# EAGLE design Buck Regulator (EAGLE 9.6.2)

## Sheet 1 of 2: Datasheet
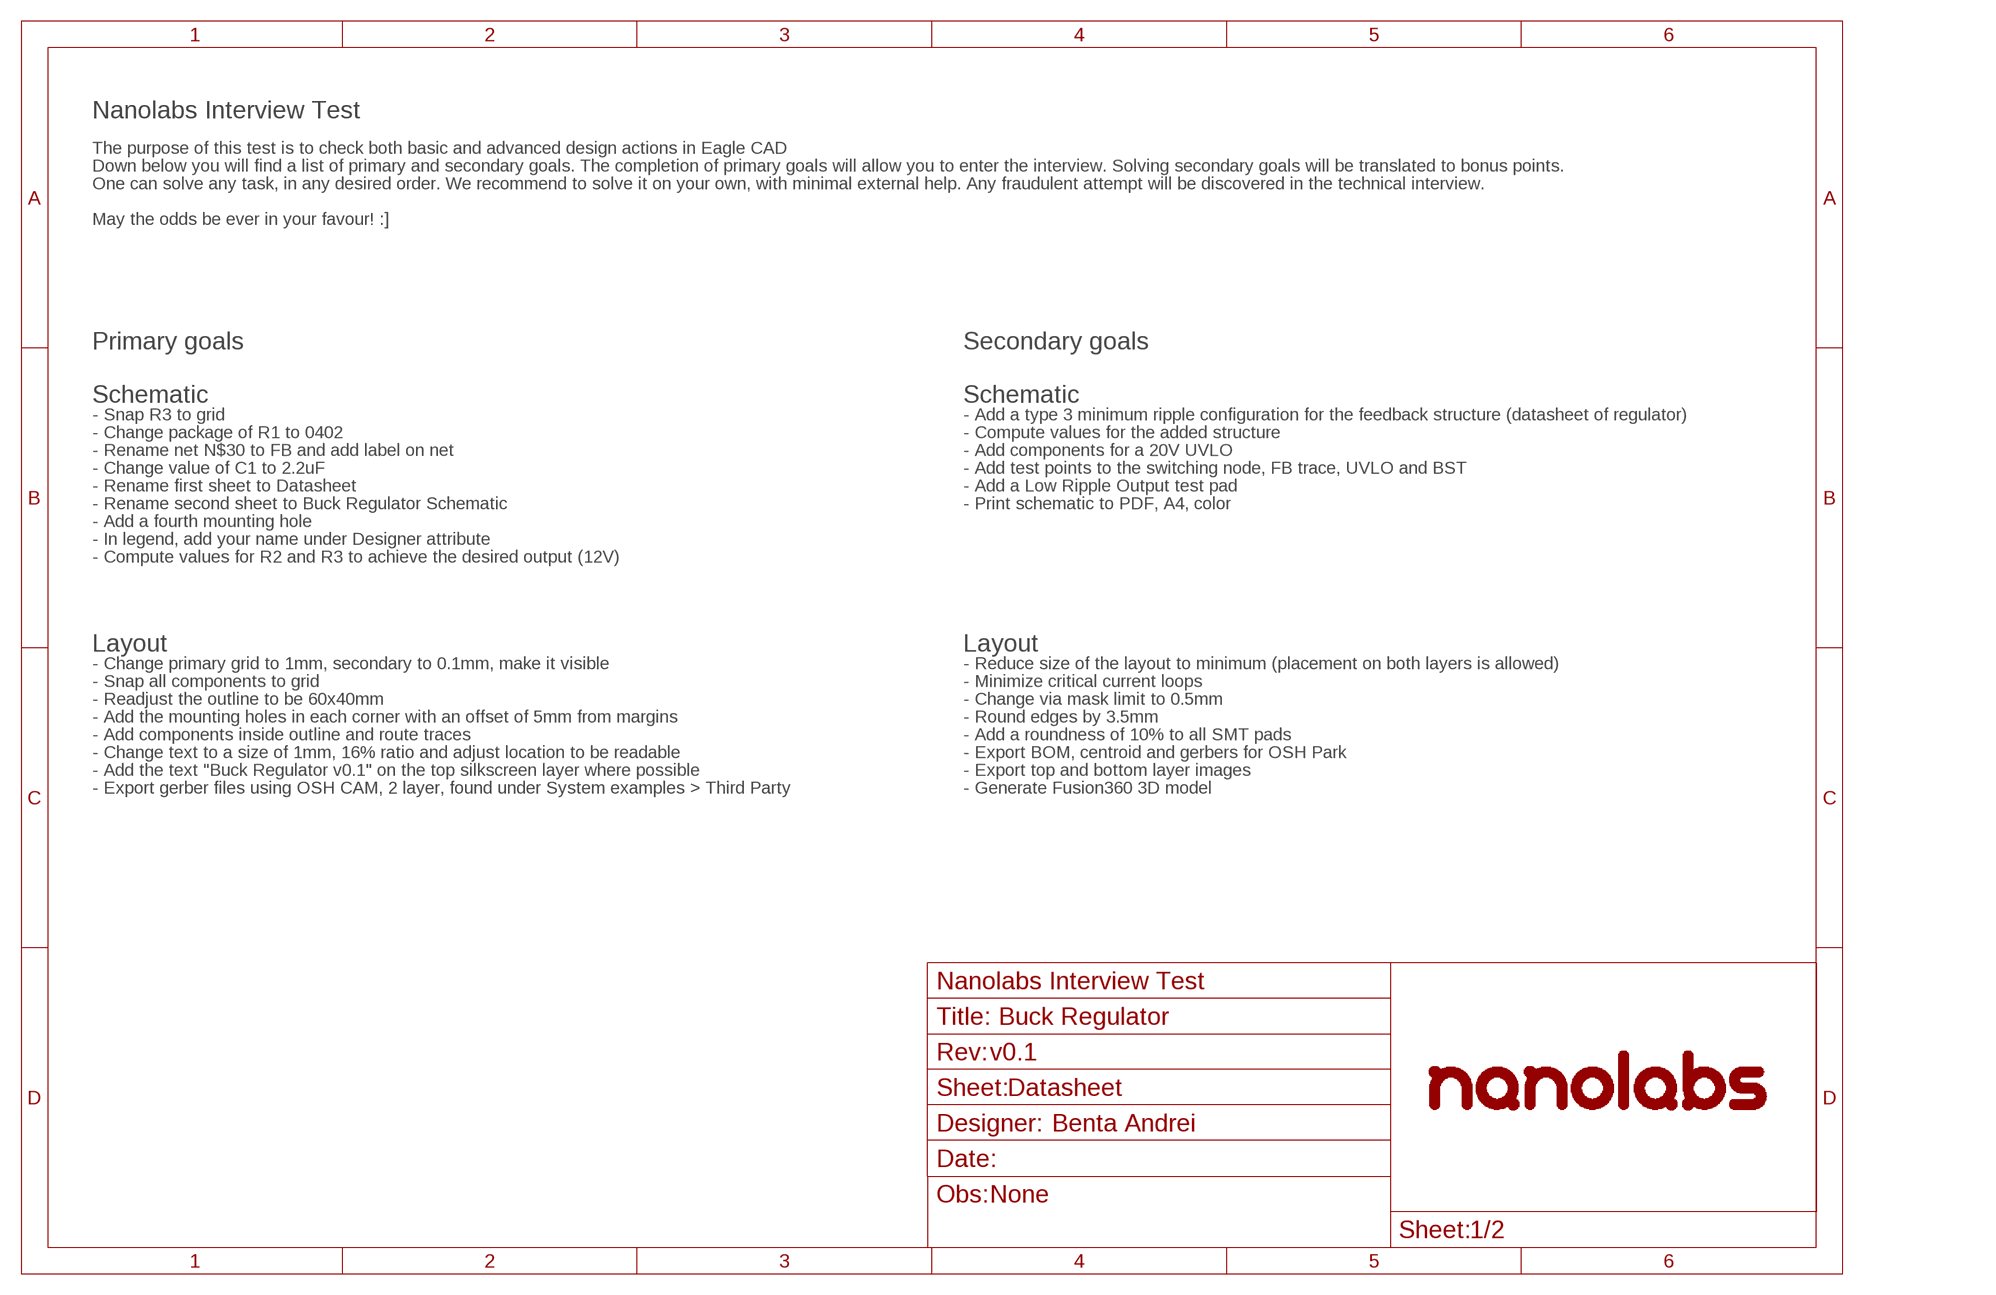
[diagram p0: schematic, sheet 1]
FRAME3 (_SCH_FRAME_A4): OBS: None; REVNUM: v0.1

### Notes on the sheet
- Nanolabs Interview Test
- The purpose of this test is to check both basic and advanced design actions in Eagle CAD
- Down below you will find a list of primary and secondary goals. The completion of primary goals will allow you to enter the interview. Solving secondary goals will be translated to bonus points.
- One can solve any task, in any desired order. We recommend to solve it on your own, with minimal external help. Any fraudulent attempt will be discovered in the technical interview.
- May the odds be ever in your favour! :]
- Primary goals | Secondary goals
- Schematic | Schematic
- - Snap R3 to grid | - Add a type 3 minimum ripple configuration for the feedback structure (datasheet of regulator)
- - Change package of R1 to 0402 | - Compute values for the added structure
- - Rename net N$30 to FB and add label on net | - Add components for a 20V UVLO
- - Change value of C1 to 2.2uF | - Add test points to the switching node, FB trace, UVLO and BST
- - Rename first sheet to Datasheet | - Add a Low Ripple Output test pad
- - Rename second sheet to Buck Regulator Schematic | - Print schematic to PDF, A4, color
- - Add a fourth mounting hole
- - In legend, add your name under Designer attribute
- - Compute values for R2 and R3 to achieve the desired output (12V)
- Layout | Layout
- - Change primary grid to 1mm, secondary to 0.1mm, make it visible | - Reduce size of the layout to minimum (placement on both layers is allowed)
- - Snap all components to grid | - Minimize critical current loops
- - Readjust the outline to be 60x40mm | - Change via mask limit to 0.5mm
- - Add the mounting holes in each corner with an offset of 5mm from margins | - Round edges by 3.5mm
- - Add components inside outline and route traces | - Add a roundness of 10% to all SMT pads
- - Change text to a size of 1mm, 16% ratio and adjust location to be readable | - Export BOM, centroid and gerbers for OSH Park
- - Add the text "Buck Regulator v0.1" on the top silkscreen layer where possible | - Export top and bottom layer images
- - Export gerber files using OSH CAM, 2 layer, found under System examples > Third Party | - Generate Fusion360 3D model
- Benta Andrei

## Sheet 2 of 2: Buck Regulator Schematic
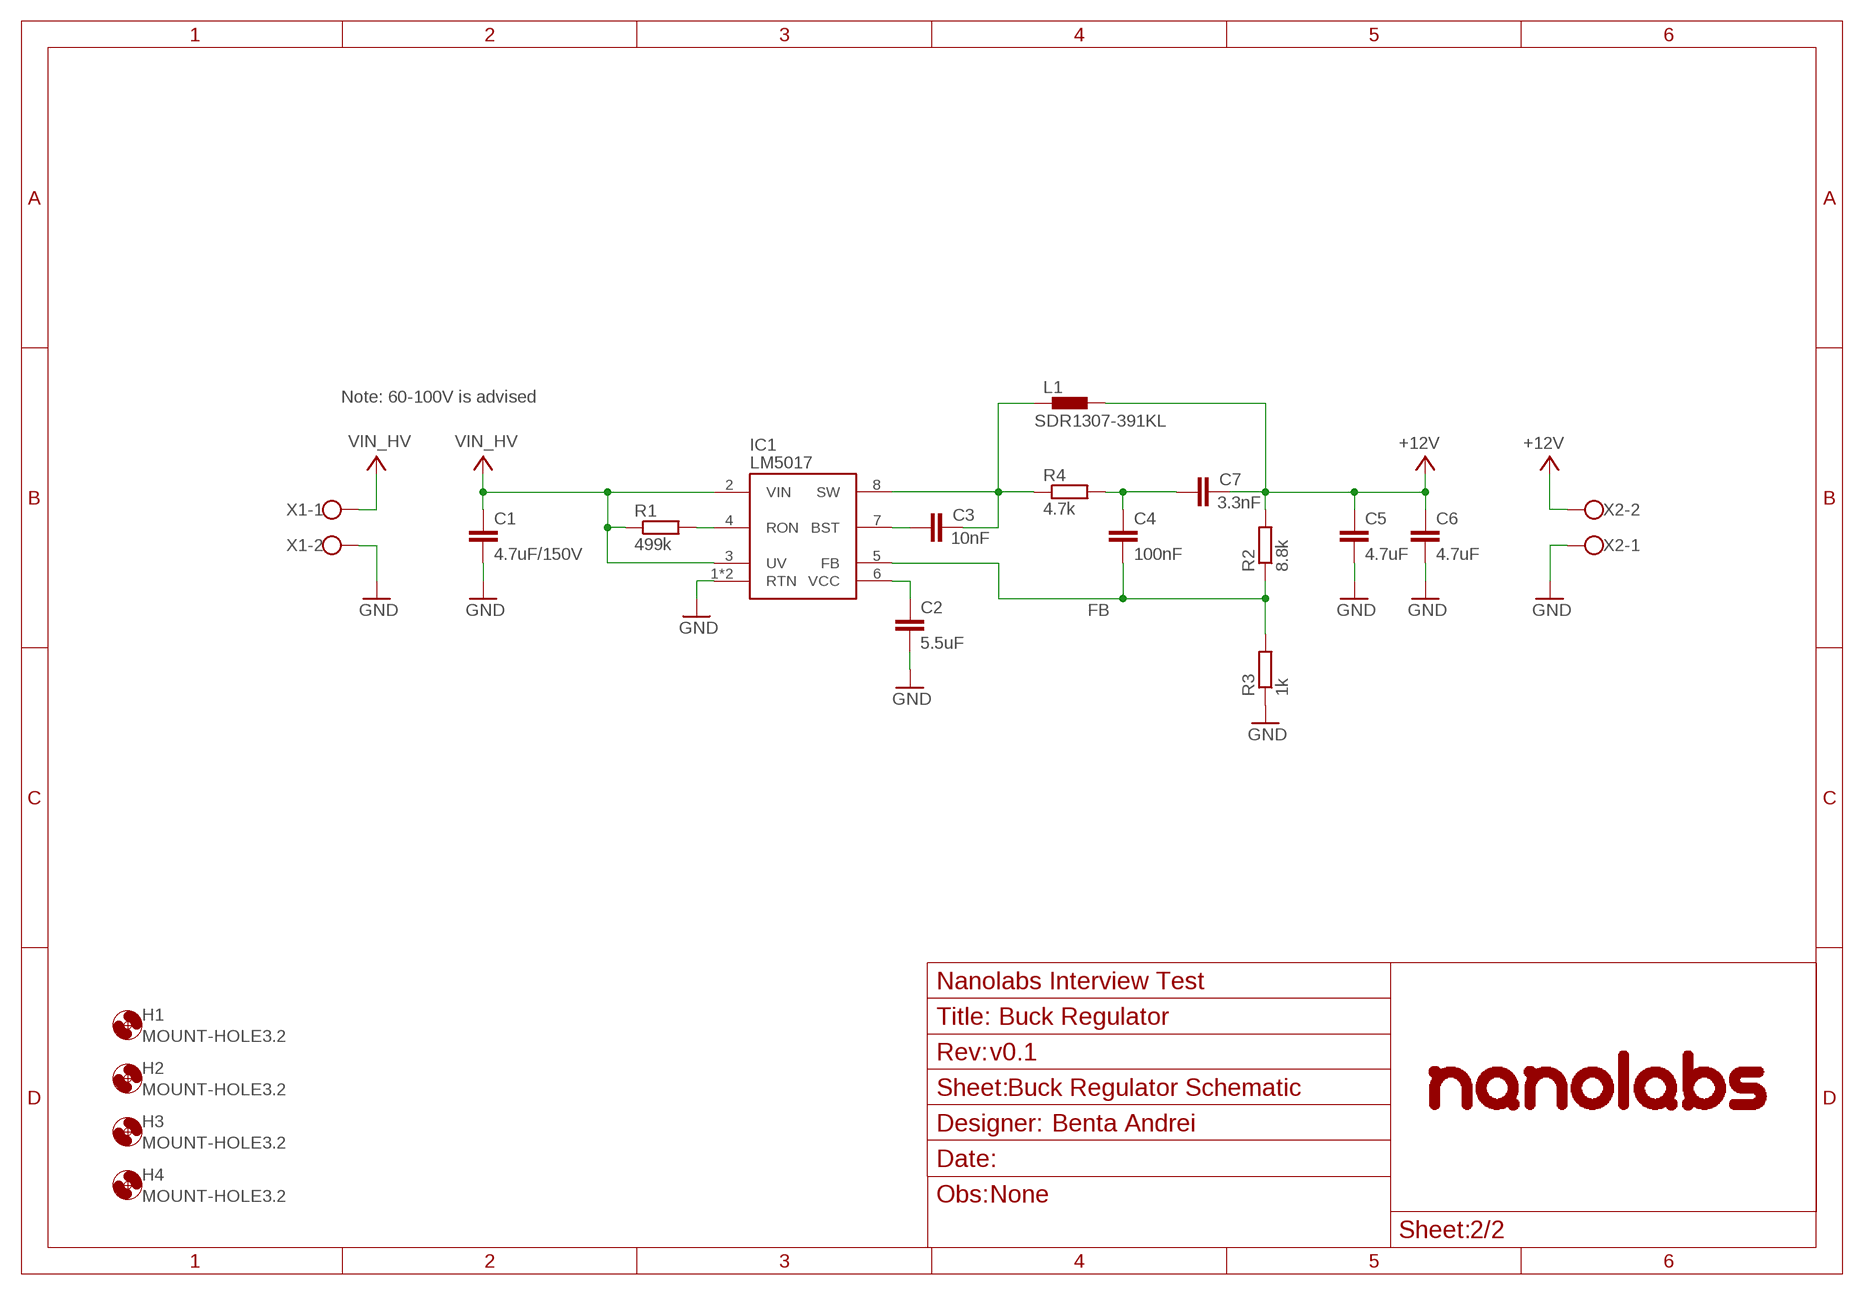
[diagram p1: schematic, sheet 2]
FRAME1 (_SCH_FRAME_A4): OBS: None; REVNUM: v0.1

### Parts
C1  4.7uF/150V  C-EUC1812  [C1812]
C2  5.5uF  C-EUC0603  [C0603]
C3  10nF  C-EUC0603  [C0603]
C4  100nF  C-EUC0603  [C0603]
C5  4.7uF  C-EUC0603  [C0603]
C6  4.7uF  C-EUC0603  [C0603]
C7  3.3nF  C-EUC0603  [C0603]
H1  MOUNT-HOLE3.2  [3,2]
H2  MOUNT-HOLE3.2  [3,2]
H3  MOUNT-HOLE3.2  [3,2]
H4  MOUNT-HOLE3.2  [3,2]
IC1  LM5017  [SO-08-EP]
L1  SDR1307-391KL  [SDR1307-391KL]
R1  499k  R-EU_R0603  [R0603]
R2  8.8k  R-EU_R0603  [R0603]
R3  1k  R-EU_R0603  [R0603]
R4  4.7k  R-EU_R0603  [R0603]
X1  W237-102  [W237-102]
X2  W237-102  [W237-102]

### Nets
+12V: C5.1 C6.1 C7.2 L1.2 R2.2 X2.2
FB: C4.2 IC1.5(FB) R2.1 R3.2
GND: C1.2 C2.2 C5.2 C6.2 IC1.1(RTN) IC1.9(RTN) R3.1 X1.2 X2.1
N$1: C4.1 C7.1 R4.2
N$23: C2.1 IC1.6(VCC)
N$28: C3.1 IC1.7(BST)
N$29: C3.2 IC1.8(SW) L1.1 R4.1
N$31: IC1.4(RON) R1.2
VIN_HV: C1.1 IC1.2(VIN) IC1.3(UV) R1.1 X1.1

### Notes on the sheet
- Note: 60-100V is advised
- Benta Andrei

## Library data of the parts
C1-C7 = rcl:C-EU: CAPACITOR, European symbol; SPICEPREFIX: C
H1-H4 = _nanolabs_layout:MOUNT-HOLE: MOUNTING HOLE with drill center marker
IC1 = _nanolabs_ic:LM5017
L1 = _nanolabs_rcl:SDR1307-391KL
R1-R4 = rcl:R-EU_: RESISTOR, European symbol; SPICEPREFIX: R
X1 X2 = con-wago-500:W237-102: WAGO SCREW CLAMP; MPN: 237-102; OC_FARNELL: unknown; OC_NEWARK: 70K9898

## Board
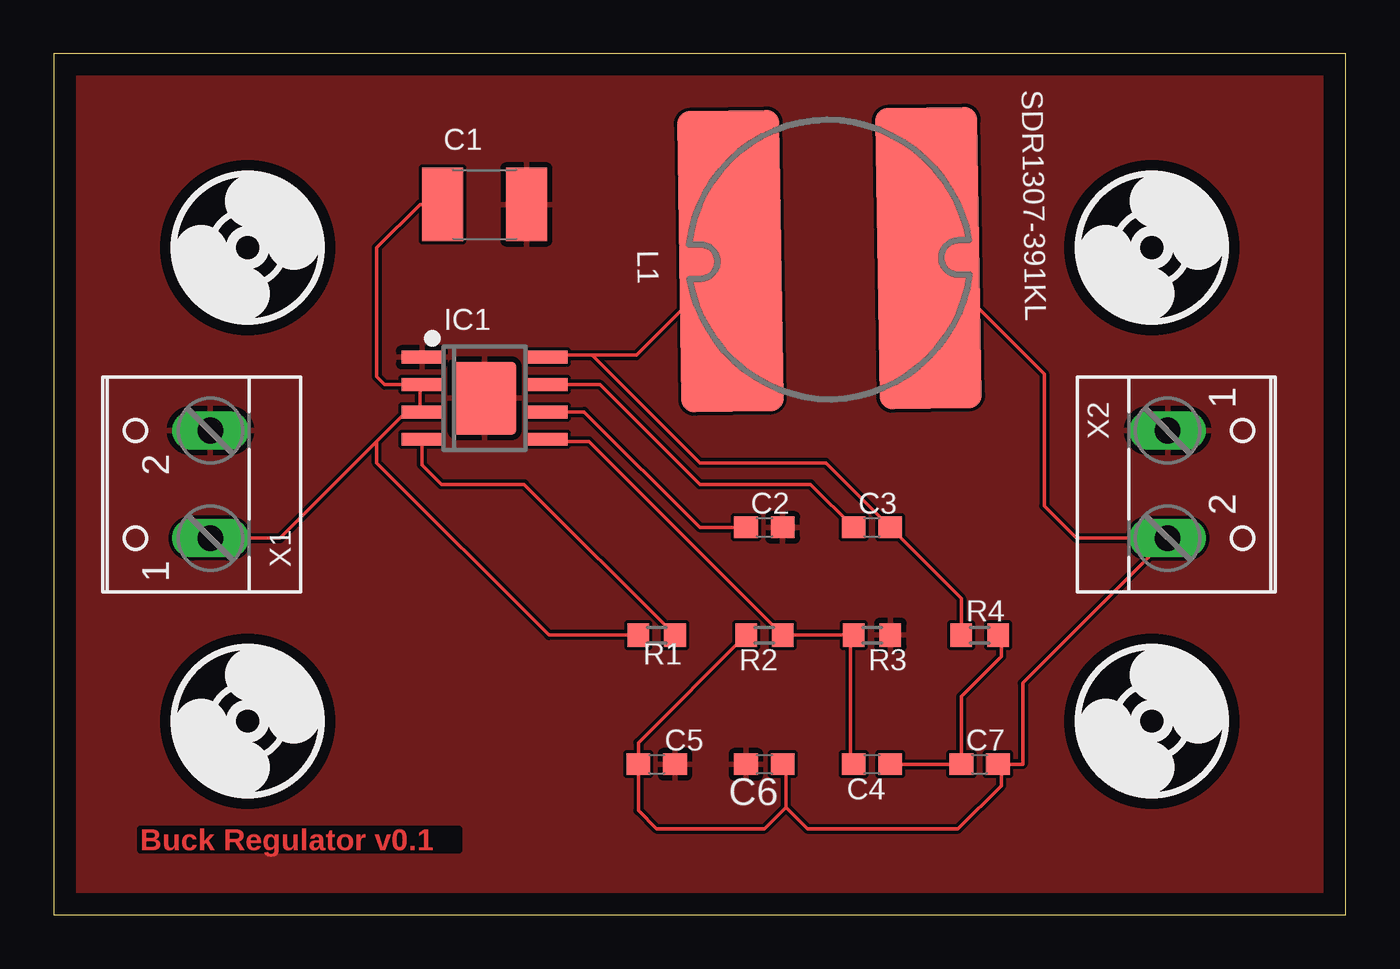
[diagram p2: board, top side]
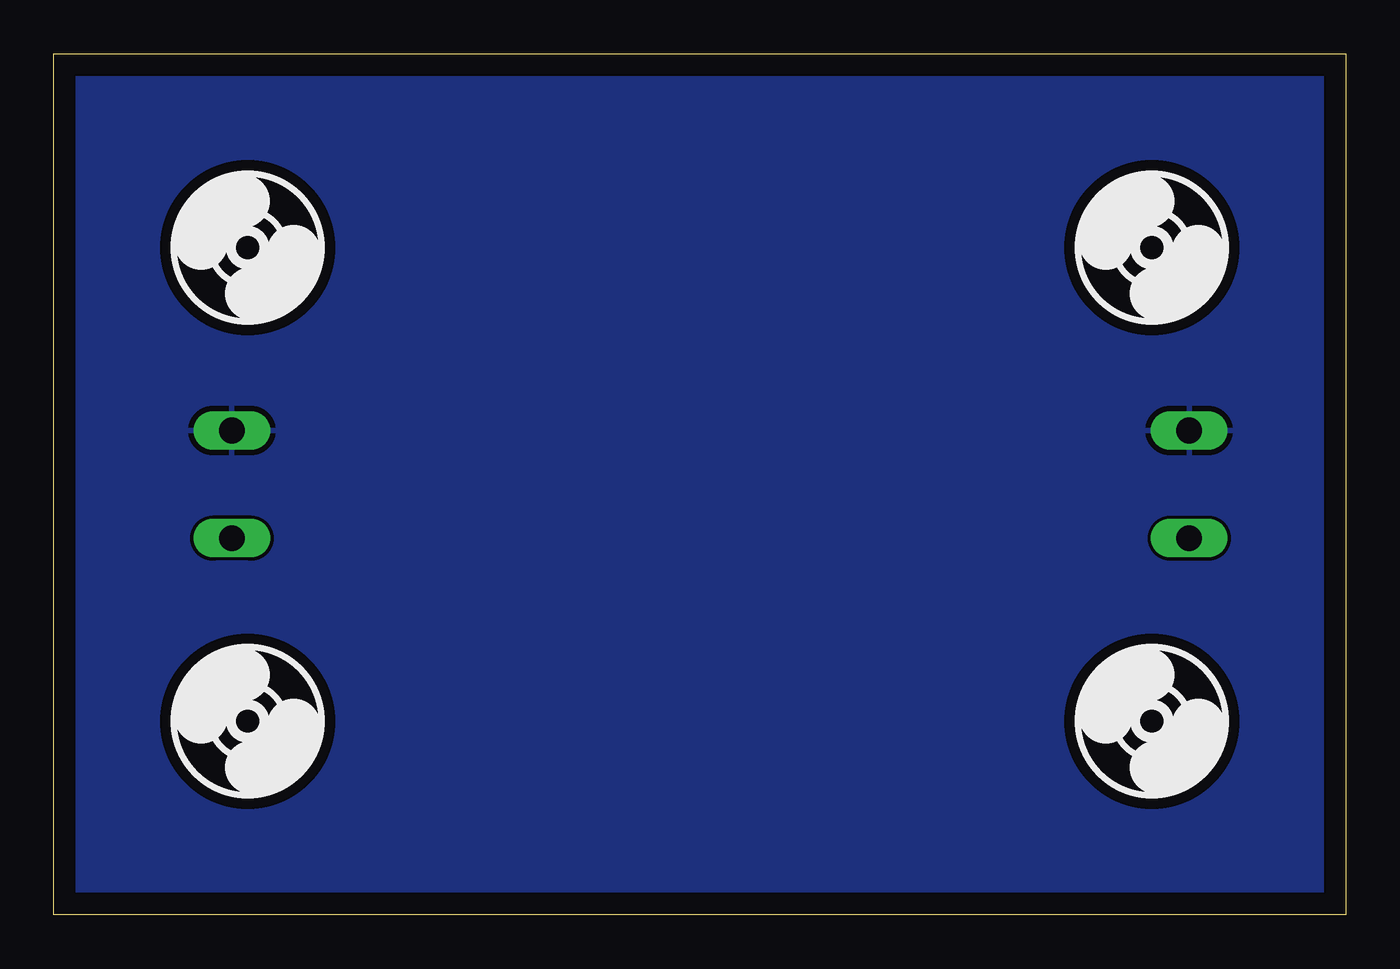
[diagram p3: board, bottom side, seen from below]

Size 60 x 40 mm. Coordinates in mm from the lower left corner, seen from the top.
Outline: 0,0 60,0 60,40 0,40 0,0
Copper layers (1*16): Top 0.035mm / dielectric 1.5mm / Bottom 0.035mm
Design rules "default": minimum track width 6mil, minimum drill 0.35mm, track to track 6mil, track to pad 6mil, pad to pad 6mil, via to via 6mil, smd to smd 6mil, copper to edge 40mil, drill to drill 6mil, minimum pad ring 10mil, minimum via ring 8mil, stop-mask expansion 4mil, vias tented up to drill 0mil, thermal gap 10mil

### Footprints (pad centres in the part's own frame; a part is rotated, then mirrored left to right if it is on the bottom)
C1812 = smd 1.9 x 3.4: 1 -1.95,0; 2 1.95,0
C0603 = smd 1.1 x 1: 1 -0.85,0; 2 0.85,0
3,2 = hole 3.2: 0,0
SO-08-EP = smd 0.6 x 1.9: 1 -1.905,-2.9; 2 -0.635,-2.9; 3 0.635,-2.9; 4 1.905,-2.9; 5 1.905,2.9; 6 0.635,2.9; 7 -0.635,2.9; 8 -1.905,2.9 | smd 3.4 x 2.95: 9 0,0
SDR1307-391KL = smd 14 x 4.75: 1 0,4.6; 2 0,-4.6
R0603 = smd 1 x 1.1: 1 -0.85,0; 2 0.85,0
W237-102 = drill 1.194 long: 1 -2.5,-1.27; 2 2.5,-1.27

### Placement (x,y rotation side)
C1  20,33 0 top
C2  33,18 0 top
C3  38,18 0 top
C4  38,7 180 top
C5  28,7 0 top
C6  33,7 180 top
C7  43,7 0 top
H1  9,9 0 top
H2  51,9 0 top
H3  9,31 0 top
H4  51,31 0 top
IC1  20,24 270 top
L1  36.02,30.44 90.9 top
R1  28,13 0 top
R2  33,13 180 top
R3  38,13 180 top
R4  43,13 0 top
X1  6,20 90 top
X2  53,20 270 top

### Tracks (layer width: path | path; a pad name or v marks a point on that pad's centre or on a via)
+12V
  Top 0.152: 44,7 45,7 45,10.77 X2.2 47.5,17.5 46,19 46,25.13 L1.2 | 44,7 C7.2 | R2.2 27.15,8 C5.1 27.15,4.85 28,4 33,4 34,5 | 34,5 34,6.85 C6.1 | 34,5 35,4 42,4 44,6 44,7
FB
  Top 0.152: IC1.5 23,22 24.85,22 R2.1 37,13 | R3.2 37,13 | C4.2 37,7.15 37,13
GND
  pour Bottom: 0,0 60,0 60,40 0,40
  pour Top: 0,0 60,0 60,40 0,40
N$1
  Top 0.152: R4.2 44,12.85 44,12 42.15,10.15 C7.1 C4.1
N$23
  Top 0.152: C2.1 30,18 24.64,23.36 IC1.6
N$28
  Top 0.152: C3.1 35.15,20 30,20 25.36,24.64 IC1.7
N$29
  Top 0.152: IC1.8 23,26 25,26 | L1.1 27.05,26 25,26 | 25,26 30,21 35.85,21 C3.2 42.15,14.7 R4.1
N$31
  Top 0.152: R1.2 21.85,20 18,20 17.1,20.9 IC1.4
VIN_HV
  Top 0.152: X1.1 10.5,17.5 15,22 | C1.1 17,33 15,31 15,25 15.37,24.64 17,24.64 | R1.1 23,13 15,21 15,22 | 15,22 16.36,23.36 IC1.3 17,23.46 17,24.64 | 17,24.64 IC1.2

### Text on the board
Top: Buck Regulator v0.1